# Altium project angry-bear.PrjPcb
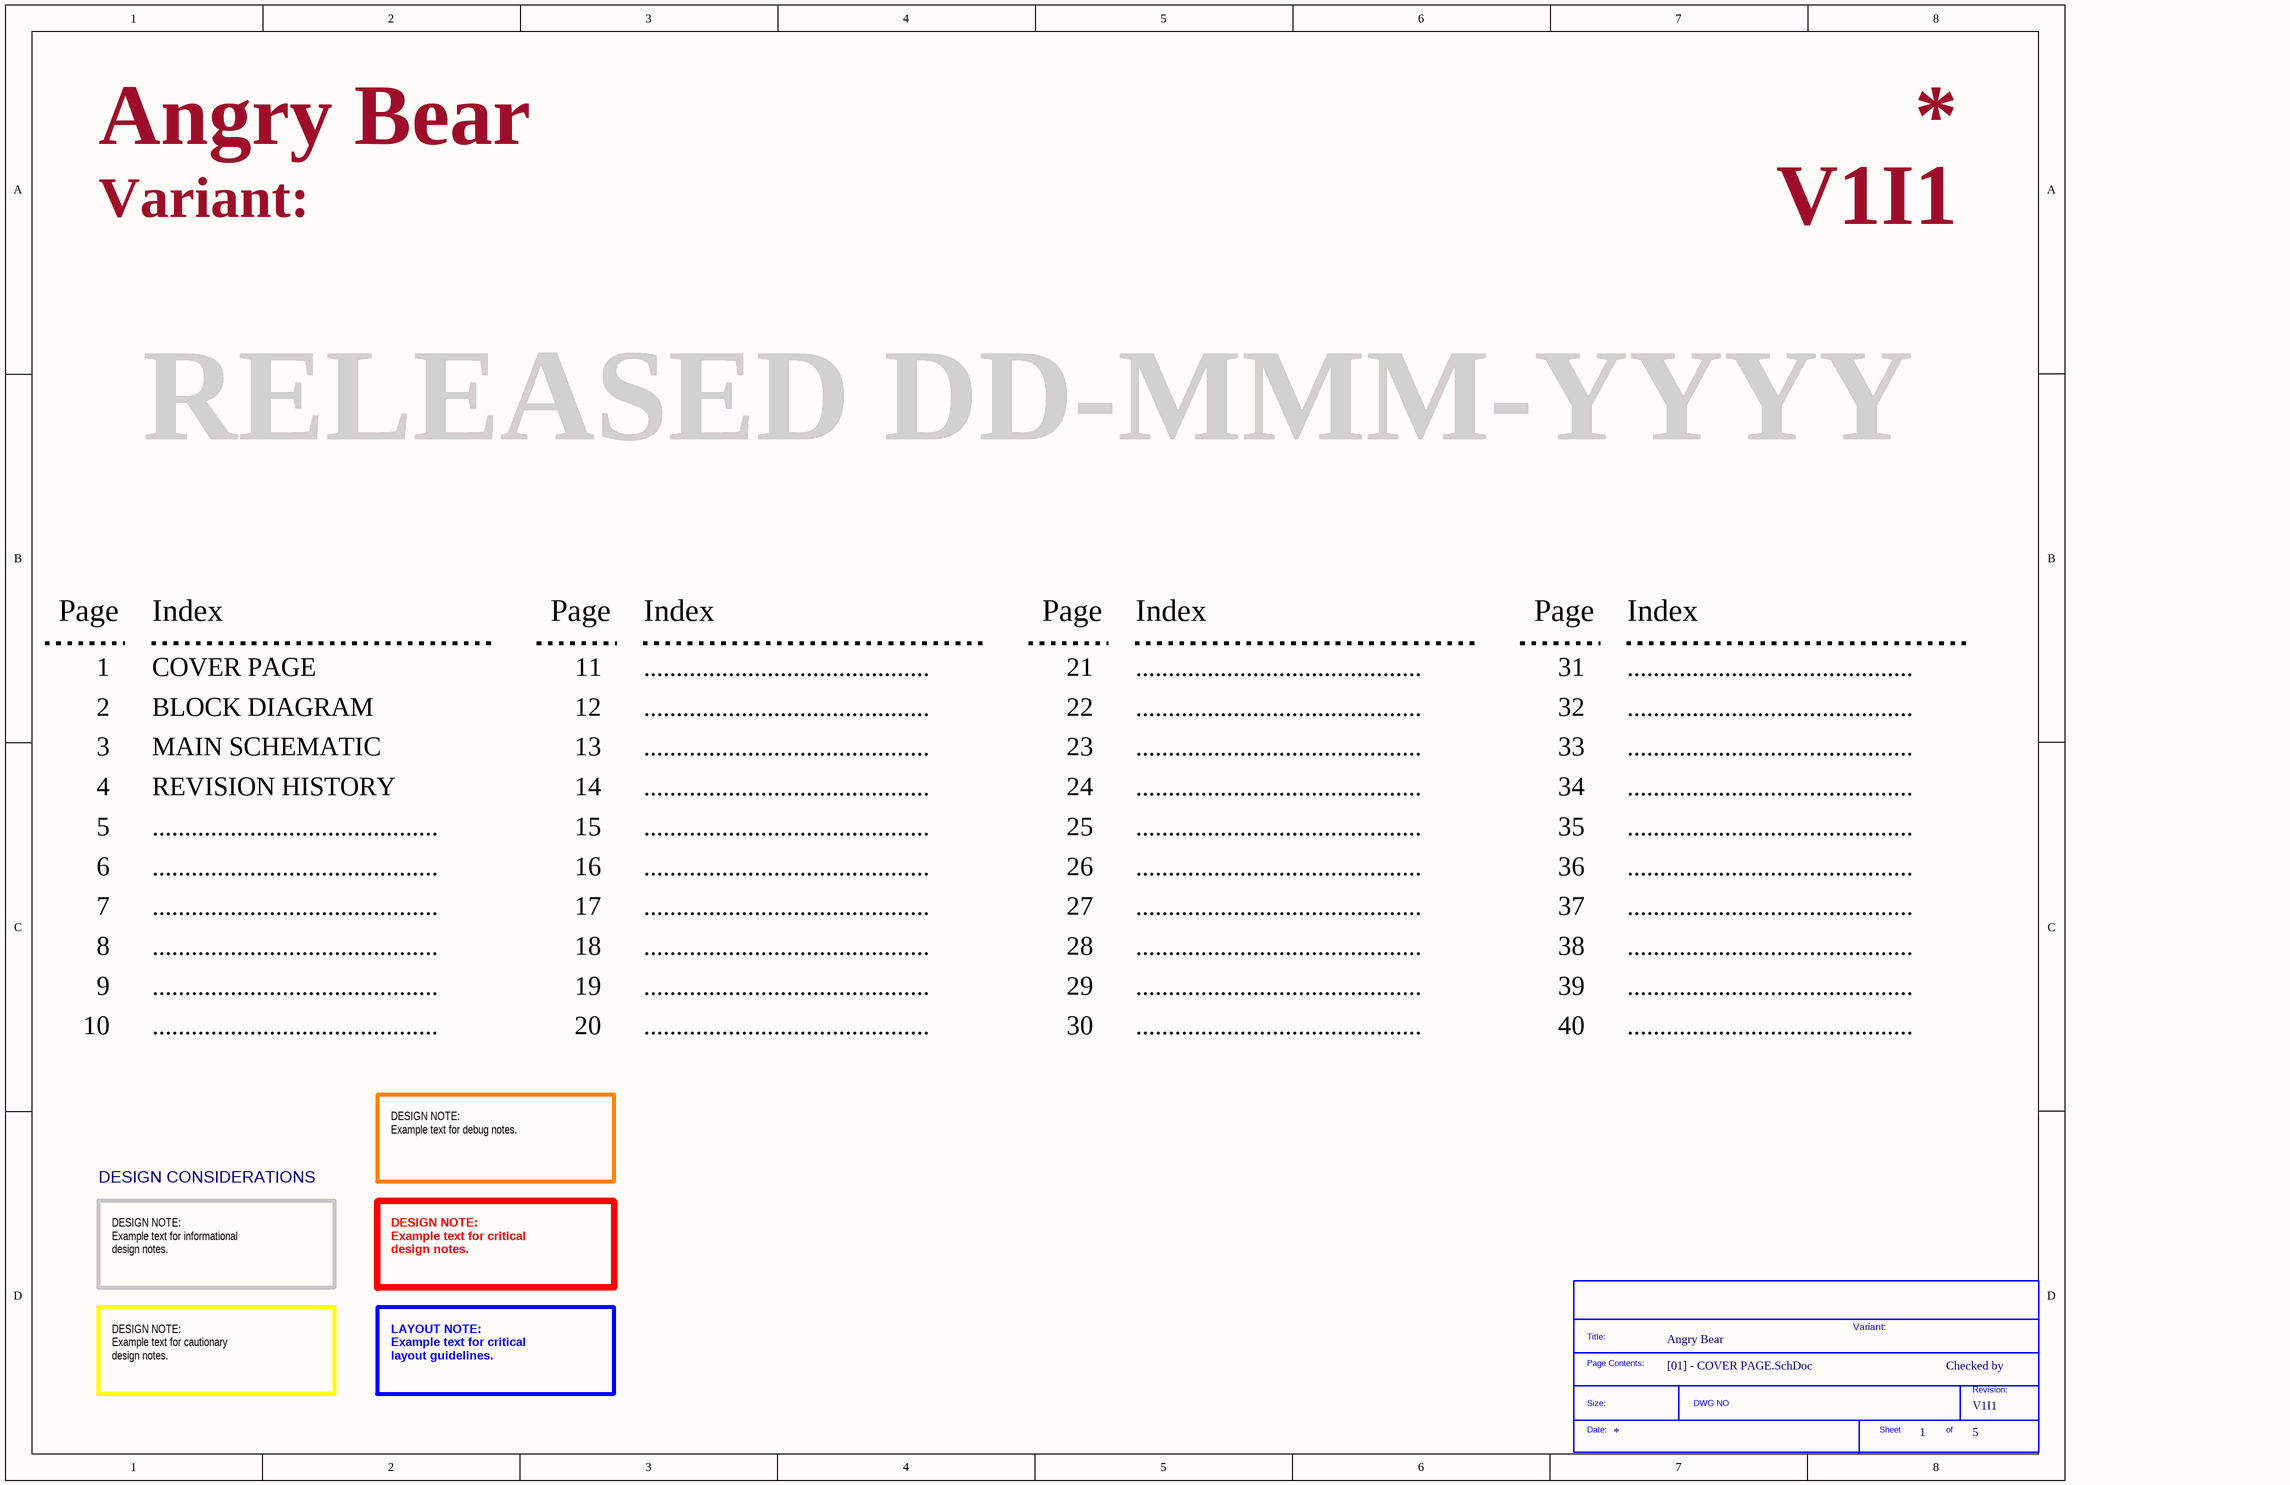
[diagram p0: [01] - COVER PAGE.SchDoc]
Project: Angry Bear; VersionRevision: V1I1
4 sheets, 22 parts. Net scope: global (net labels, ports and power ports of the same name join across sheets).
Sheets:
  [01] - COVER PAGE.SchDoc
  [02] - BLOCK DIAGRAM.SchDoc
  [03] - MAIN SCHEMATIC.SchDoc
  [04] - REVISION HISTORY.SchDoc

## Sheet [01] - COVER PAGE.SchDoc
size A3; DocumentNumber: 1; SheetNumber: 1; SheetTotal: 5

### Parts
(Parts that share a designator on the sheet are numbered #1, #2 ... from top to bottom, then left to right.)
*#1  SDTitleBlock  (value not drawn)  (graphical)

### Notes on the sheet
- Variant:
- RELEASED DD-MMM-YYYY
- Page
- Index
- 1
- COVER PAGE
- 11
- ............................................
- 21
- 31
- 2
- 3
- BLOCK DIAGRAM
- MAIN SCHEMATIC
- 12
- 13
- 22
- 23
- 32
- 33
- 4
- 5
- REVISION HISTORY
- 14
- 15
- 24
- 25
- 34
- 35
- 6
- 16
- 26
- 36
- 7
- 8
- 17
- 18
- 27
- 28
- 37
- 38
- 9
- 10
- 19
- 20
- 29
- 30
- 39
- 40
- DESIGN NOTE:
  Example text for debug notes.
- DESIGN CONSIDERATIONS
- DESIGN NOTE:
  Example text for informational
  design notes.
- DESIGN NOTE:
  Example text for critical
  design notes.
- Checked by
- DESIGN NOTE:
  Example text for cautionary
  design notes.
- LAYOUT NOTE:
  Example text for critical
  layout guidelines.
- (in symbol SDTitleBlock) Title:; Page Contents:; Revision:; Size:; DWG NO; Date:; Sheet; of

## Sheet [02] - BLOCK DIAGRAM.SchDoc
size A3; DocumentNumber: 2; SheetNumber: 2; SheetTotal: 5; PageSetup: Record=PageOptions|CenterHorizontal=True|CenterVertical=True|PrintScale=0.52|XCorrection=1.00|YCorrection=1.00|PrintKind=1|BorderSize=5000000|LeftOffset=0|BottomOffset=0|Orientation=2|PaperLength=1000|PaperWidth=1000|Scale=100|PaperSource=4|PrintQuality=600|MediaType=1|DitherType=10|PrintScaleMode=1|PaperKind=A4|PaperIndex=9
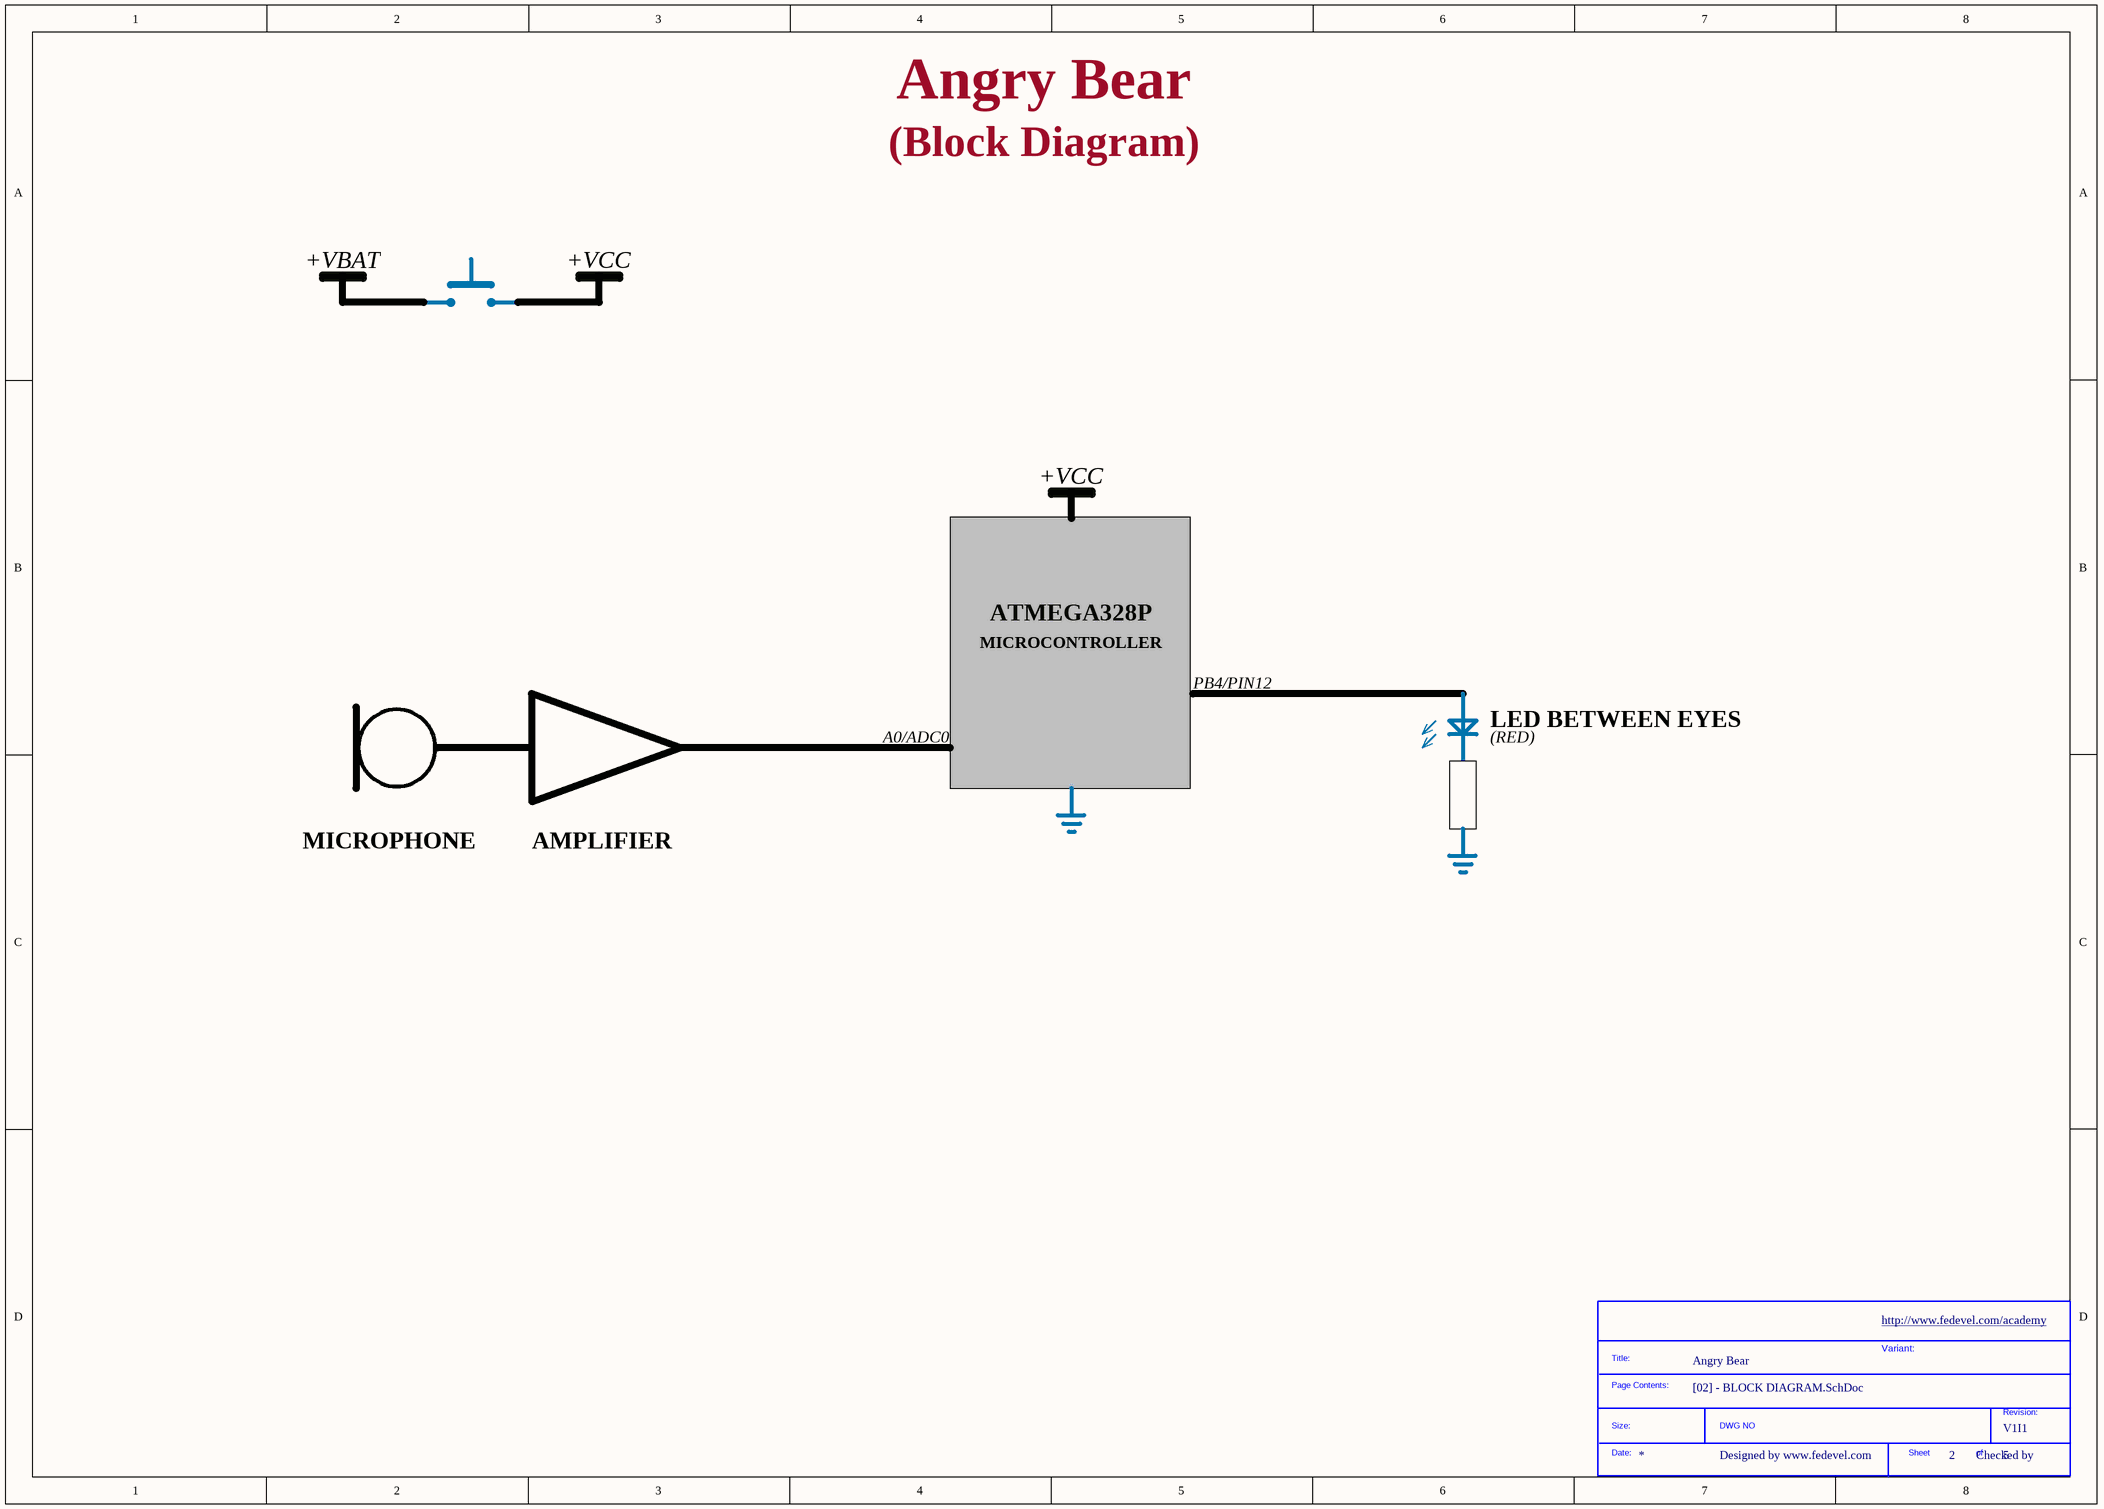
[diagram p1: [02] - BLOCK DIAGRAM.SchDoc]

### Parts
(Parts that share a designator on the sheet are numbered #1, #2 ... from top to bottom, then left to right.)
*#2  SDTitleBlock  (value not drawn)  (graphical)

### Notes on the sheet
- (Block Diagram)
- +VBAT
- +VCC
- ATMEGA328P
- MICROCONTROLLER
- PB4/PIN12
- A0/ADC0
- LED BETWEEN EYES
- (RED)
- MICROPHONE
- AMPLIFIER
- http://www.fedevel.com/academy
- Variant:
- Designed by www.fedevel.com
- Checked by
- (in symbol SDTitleBlock) Title:; Page Contents:; Revision:; Size:; DWG NO; Date:; Sheet; of

## Sheet [03] - MAIN SCHEMATIC.SchDoc
size A3; DocumentNumber: 2; SheetNumber: 2; SheetTotal: 5; PageSetup: Record=PageOptions|CenterHorizontal=True|CenterVertical=True|PrintScale=0.52|XCorrection=1.00|YCorrection=1.00|PrintKind=1|BorderSize=5000000|LeftOffset=0|BottomOffset=0|Orientation=2|PaperLength=1000|PaperWidth=1000|Scale=100|PaperSource=4|PrintQuality=600|MediaType=1|DitherType=10|PrintScaleMode=1|PaperKind=A4|PaperIndex=9
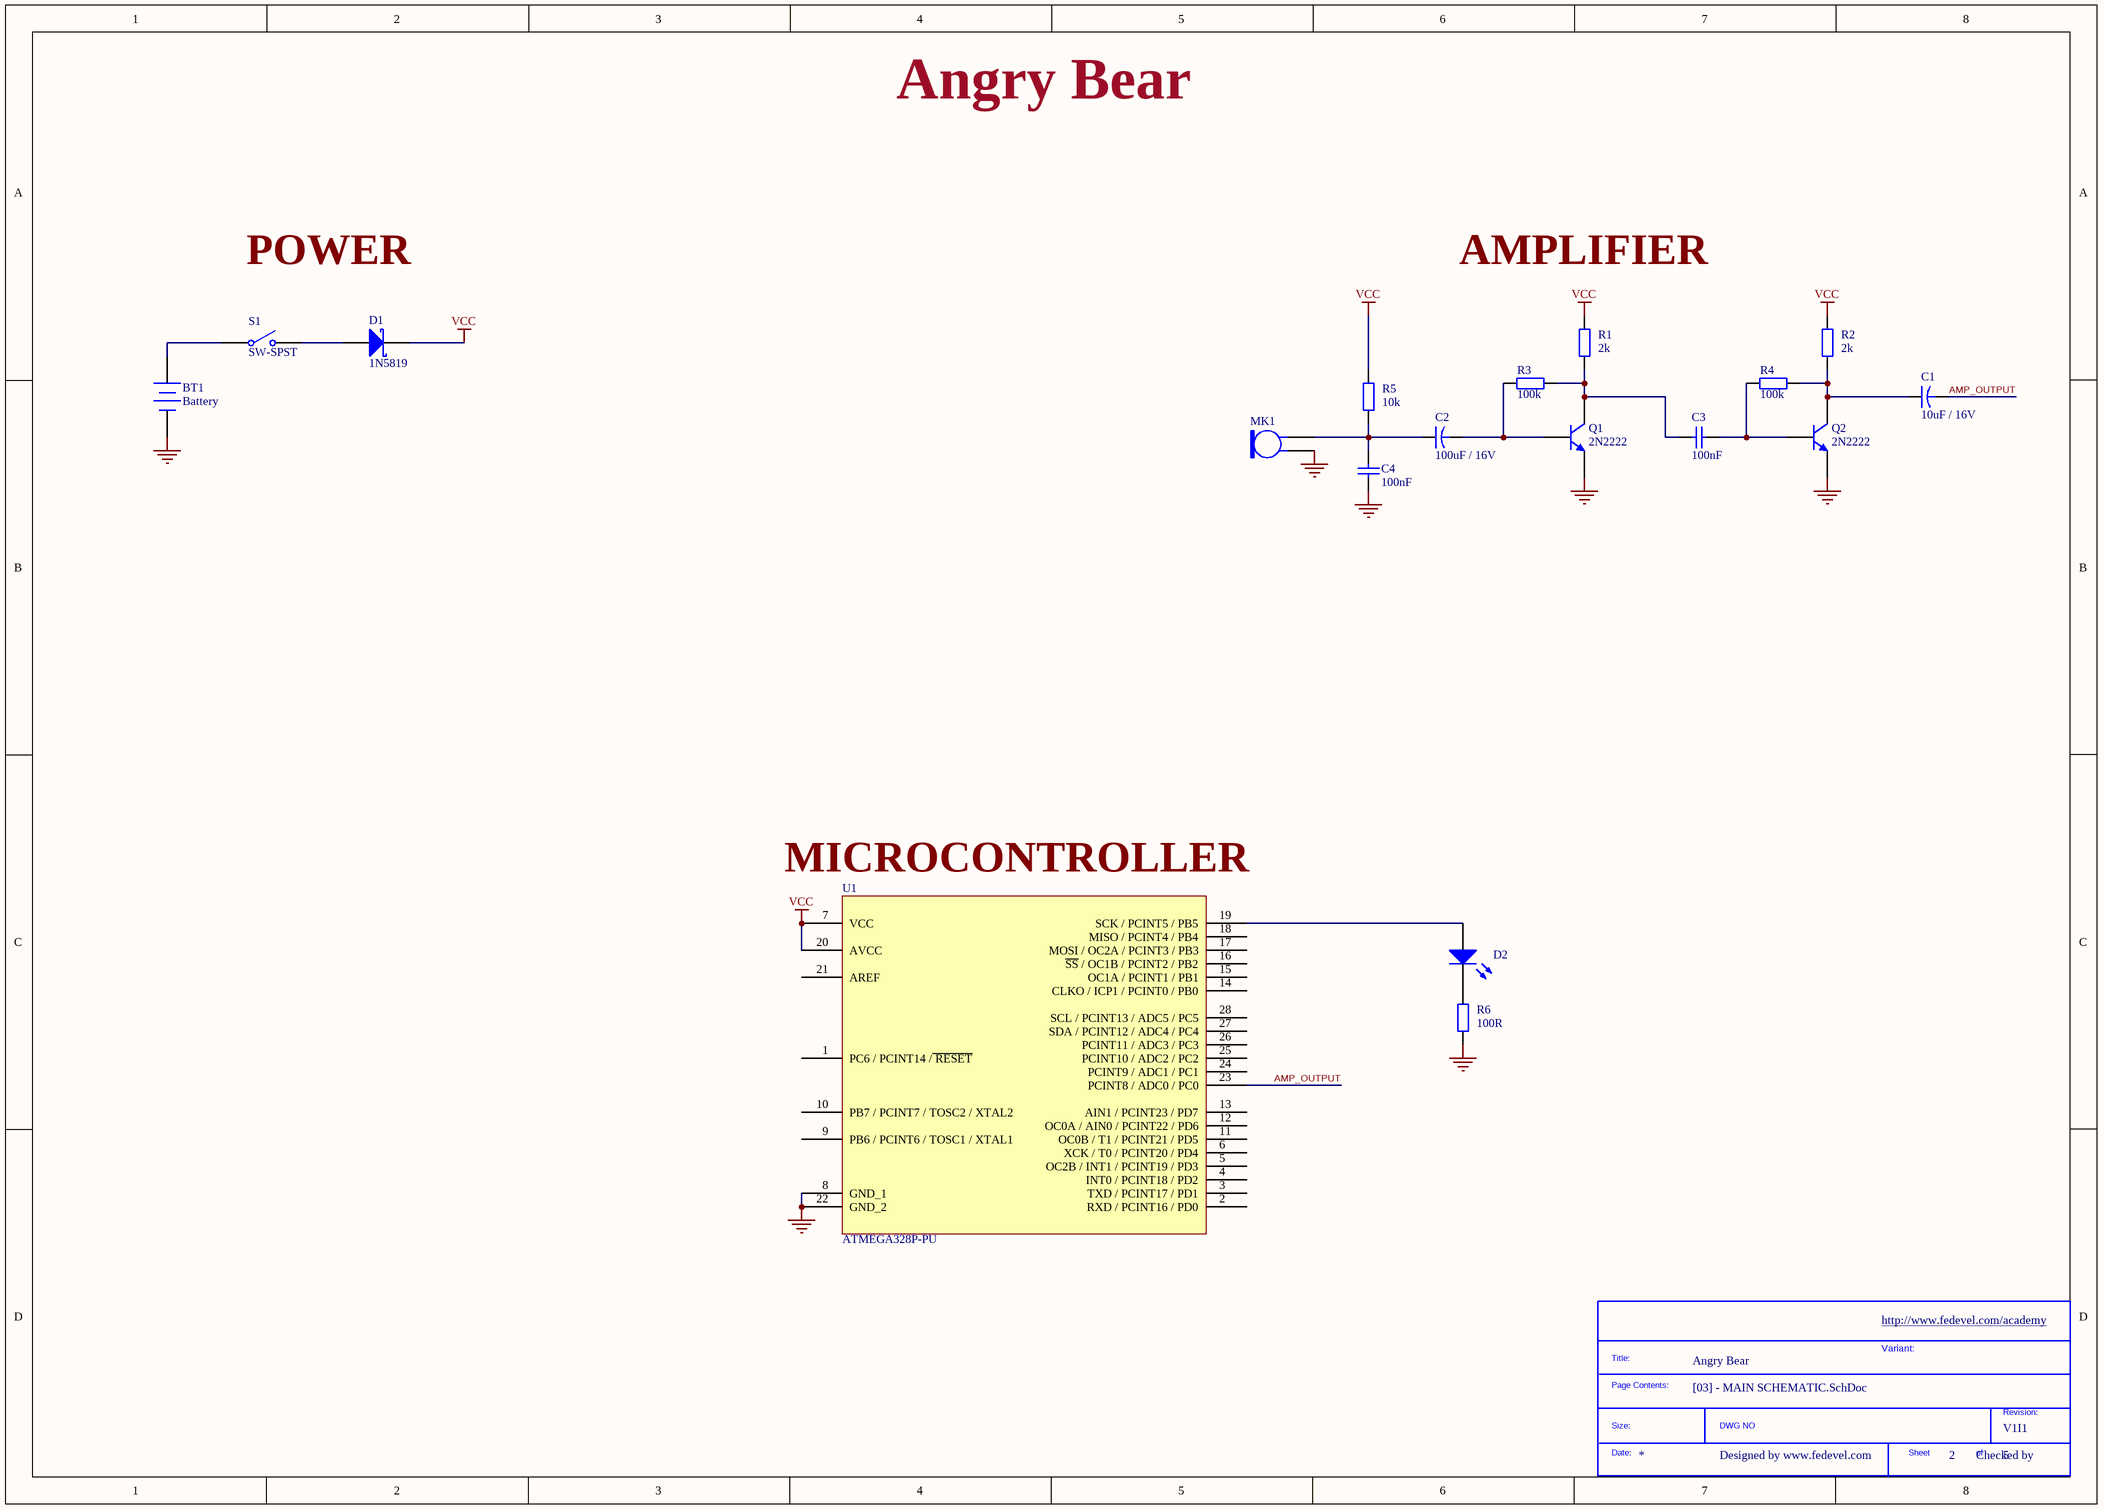
[diagram p2: [03] - MAIN SCHEMATIC.SchDoc]

### Parts
(Parts that share a designator on the sheet are numbered #1, #2 ... from top to bottom, then left to right.)
*#3  SDTitleBlock  (value not drawn)  (graphical)
BT1  Battery  [BAT-2]
C1  10uF / 16V  [CAPR5-4X5]
C2  100uF / 16V  [CAPR5-4X5]
C3  100nF  [RAD-0.3]
C4  100nF  [RAD-0.3]
D1  1N5819  [DO-204AL]
D2  LED0  [LED-0]  (value not drawn)
MK1  Mic2  [PIN2]  (value not drawn)
Q1  2N2222  [TO-226-AA]
Q2  2N2222  [TO-226-AA]
R1  2k  [AXIAL-0.4]
R2  2k  [AXIAL-0.4]
R3  100k  [AXIAL-0.4]
R4  100k  [AXIAL-0.4]
R5  10k  [AXIAL-0.4]
R6  100R  [AXIAL-0.4]
S1  SW-SPST  [SPST-2]
U1  ATMEGA328P-PU  [28_DIP_7.62mm]

### Nets
GND: BT1.2(-) C4.1 MK1.1 Q1.3(E) Q2.3(E) R6.1 U1.8(GND_1) U1.22(GND_2)
VCC: D1.2(K) R1.2 R2.2 R5.2 U1.7(VCC) U1.20(AVCC)
AMP_OUTPUT: C1.2 U1.23(PCINT8_/_ADC0_/_PC0)
NetBT1_1: BT1.1(+) S1.1(COMMON)
NetC1_1: C1.1 Q2.1(C) R2.1 R4.2
NetC2_1: C2.1 C4.2 MK1.2 R5.1
NetC2_2: C2.2 Q1.2(B) R3.1
NetC3_1: C3.1 Q1.1(C) R1.1 R3.2
NetC3_2: C3.2 Q2.2(B) R4.1
NetD1_1: D1.1(A) S1.2(NO)
NetD2_1: D2.1(A) U1.19(SCK_/_PCINT5_/_PB5)
NetD2_2: D2.2(K) R6.2

Not connected (* = marked no-connect by the designer): U1 1(PC6_/_PCINT14_/~{_RESET}) 2(RXD_/_PCINT16_/_PD0) 3(TXD_/_PCINT17_/_PD1) 4(INT0_/_PCINT18_/_PD2) 5(OC2B_/_INT1_/_PCINT19_/_PD3) 6(XCK_/_T0_/_PCINT20_/_PD4) 9(PB6_/_PCINT6_/_TOSC1_/_XTAL1) 10(PB7_/_PCINT7_/_TOSC2_/_XTAL2) 11(OC0B_/_T1_/_PCINT21_/_PD5) 12(OC0A_/_AIN0_/_PCINT22_/_PD6) 13(AIN1_/_PCINT23_/_PD7) 14(CLKO_/_ICP1_/_PCINT0_/_PB0) 15(OC1A_/_PCINT1_/_PB1) 16(~{SS}_/_OC1B_/_PCINT2_/_PB2) 17(MOSI_/_OC2A_/_PCINT3_/_PB3) 18(MISO_/_PCINT4_/_PB4) 21(AREF) 24(PCINT9_/_ADC1_/_PC1) 25(PCINT10_/_ADC2_/_PC2) 26(PCINT11_/_ADC3_/_PC3) 27(SDA_/_PCINT12_/_ADC4_/_PC4) 28(SCL_/_PCINT13_/_ADC5_/_PC5)

### Notes on the sheet
- POWER
- AMPLIFIER
- (near U1) MICROCONTROLLER
- http://www.fedevel.com/academy
- Variant:
- Designed by www.fedevel.com
- Checked by
- (in symbol SDTitleBlock) Title:; Page Contents:; Revision:; Size:; DWG NO; Date:; Sheet; of

### Library data of the parts
BT1 = Battery: Multicell Battery; Published: 24-Mar-1999; LatestRevisionDate: 17-Jul-2002; LatestRevisionNote: Re-released for DXP Platform.; PackageReference: BAT-2; Publisher: Altium Limited; PackageDescription: Battery; 2 Leads
C1 C2 = Cap2: Capacitor; Value: 100pF; Published: 23-Sep-2002; PackageReference: CAPR5-4X5; Publisher: Altium Limited; PackageDescription: Capacitor; 2 Leads
C3 C4 = Cap: Capacitor; Value: 100pF; Published: 8-Jun-2000; LatestRevisionDate: 17-Jul-2002; LatestRevisionNote: Re-released for DXP Platform.; PackageReference: RAD-0.3; Publisher: Altium Limited; PackageDescription: Radial Cap, Thru-Hole; 2 Leads; 0.3 in Pin Spacing
D1 = Diode 11DQ03: Schottky Rectifier; Published: 8-Jun-2000; LatestRevisionDate: 17-Jul-2002; LatestRevisionNote: Re-released for DXP Platform.; DatasheetVersion: Dec-1997; PackageReference: DO-204AL; Publisher: Altium Limited; PackageDescription: Diode, Axial; Body 5.2 x 2.7 mm (LxDia. max), Lead Dia. 0.86 mm (max); Code_JEDEC: DO-204-AL; ComponentLink1Description: Manufacturer Link; ComponentLink1URL: http://www.irf.com/; ComponentLink2Description: Datasheet; ComponentLink2URL: http://www.irf.com/product-info/datasheets/data/11dq03.pdf
D2 = LED0: Typical INFRARED GaAs LED; Published: 8-Jun-2000; LatestRevisionDate: 08-Jul-2005; LatestRevisionNote: Mech Layer 1 removed.; PackageReference: LED-0; Publisher: Altium Limited; PackageDescription: LED; 2 Leads
MK1 = Mic2: Microphone; Published: 24-Mar-1999; LatestRevisionDate: 17-Jul-2002; LatestRevisionNote: Re-released for DXP Platform.; PackageReference: PIN2; Publisher: Altium Limited
Q1 Q2 = NPN: NPN Bipolar Transistor; Manufacturer: ON Semiconductor; Manufacturer Part Number: P2N2222AG; Collector Emitter Voltage V(br)ceo: 40V; Transition Frequency ft: 300MHz; Power Dissipation Pd: 625mW; DC Collector Current: 600mA; DC Current Gain hFE: 300hFE; Transistor Case Style: TO-92; No. of Pins: 3Pins; SVHC: No SVHC (17-Dec-2015); Published: 8-Jun-2000; LatestRevisionDate: 17-Jul-2002; LatestRevisionNote: Re-released for DXP Platform.; PackageReference: TO-226-AA; Publisher: Altium Limited; PackageDescription: TO, Flat Index; 3 In-Line, Axial Leads; Body Dia. 4.8mm; Leads 0.55 x 0.51 mm (max); Code_JEDEC: TO-226-AA; Supplier 1: Newark; Supplier Part Number 1: 42K2503; Stock 1: 0; Transistor Polarity: NPN; Operating Temperature Max: 150°C; Product Range: -; Automotive Qualification Standard: -; MSL: MSL 1 - Unlimited; ComponentLink1URL: https://www.onsemi.com/pub/Collateral/P2N2222A-D.PDF?src-supplier=Digi-Key; ComponentLink1Description: https://www.onsemi.com/pub/Collateral/P2N2222A-D.PDF?src-supplier=Digi-Key; ComponentLink2URL: http://www.mouser.com/ds/2/308/on%20semiconductor_p2n2222a-d-548821.pdf?src-supplier=Mouser; ComponentLink2Description: http://www.mouser.com/ds/2/308/on%20semiconductor_p2n2222a-d-548821.pdf?src-supplier=Mouser; ComponentLink3URL: http://www.onsemi.com/pub/Collateral/P2N2222A-D.PDF?src-supplier=Avnet; ComponentLink3Description: http://www.onsemi.com/pub/Collateral/P2N2222A-D.PDF?src-supplier=Avnet; ComponentLink4URL: http://www.onsemi.com/pub/Collateral/P2N2222A-D.PDF?src-supplier=Avnet+Europe; ComponentLink4Description: http://www.onsemi.com/pub/Collateral/P2N2222A-D.PDF?src-supplier=Avnet+Europe; ComponentLink5URL: http://www.onsemi.com/pub_link/Collateral/P2N2222A-D.PDF?src-supplier=Future+Electronics; ComponentLink5Description: http://www.onsemi.com/pub_link/Collateral/P2N2222A-D.PDF?src-supplier=Future+Electronics; ComponentLink6URL: https://www.verical.com/server-webapp/html/getDatasheet?partID=69103&src-supplier=Verical; ComponentLink6Description: https://www.verical.com/server-webapp/html/getDatasheet?partID=69103&src-supplier=Verical
R1-R6 = Res2: Resistor; Value: 1K; Published: 8-Jun-2000; LatestRevisionDate: 17-Jul-2002; LatestRevisionNote: Re-released for DXP Platform.; PackageReference: AXIAL-0.4; Publisher: Altium Limited; PackageDescription: Axial Device, Thru-Hole; 2 Leads; 0.4 in Pin Spacing
S1 = SW-SPST: Single-Pole, Single-Throw Switch; Published: 24-Mar-1999; LatestRevisionDate: 17-Jul-2002; LatestRevisionNote: Re-released for DXP Platform.; PackageReference: SPST-2; Publisher: Altium Limited; PackageDescription: Switch; 2 Leads
U1 = ATMEGA328P-PU: IC MCU 8BIT 32KB FLASH 28DIP; Manufacturer: Atmel; Core Processor: AVR; Core Size: 8-Bit; Speed: 20MHz; Connectivity: I²C, SPI, UART/USART; Peripherals: Brown-out Detect/Reset, POR, PWM, WDT; Number of I/O: 23; Program Memory Size: 32KB (16K x 16); EEPROM Size: 1K x 8; RAM Size: 2K x 8; Voltage - Supply (Vcc/Vdd): 1.8 V ~ 5.5 V; Data Converters: A/D 6x10b; Oscillator Type: Internal; .Creator: MM; .Checked PCB: RF; Supplier 1: Digi-Key; Manufacturer Part Number: ATMEGA328P-PU; RoHS: RoHS Compliant; Category: Integrated Circuits (ICs); Stock 1: 47234; Pricing 1: 1=3.7, 10=3.305, 100=2.7103, 250=2.44588, 500=2.19468, 1000=1.85094 (USD); Packaging: Tube; Program Memory Type: FLASH; Operating Temperature: -40°C ~ 85°C; Package / Case: 28-DIP (0.300", 7.62mm); Supplier Device Package: 28-PDIP; ComponentLink1URL: http://www.atmel.com/images/atmel-8271-8-bit-avr-microcontroller-atmega48a-48pa-88a-88pa-168a-168pa-328-328p_datasheet_summary.pdf; ComponentLink1Description: http://www.atmel.com/images/atmel-8271-8-bit-avr-microcontroller-atmega48a-48pa-88a-88pa-168a-168pa-328-328p_datasheet_summary.pdf; Supplier Part Number 1: ATMEGA328P-PU-ND; .Checked SCH: RF

## Sheet [04] - REVISION HISTORY.SchDoc
size A3; DocumentNumber: 4; SheetNumber: 4; SheetTotal: 5
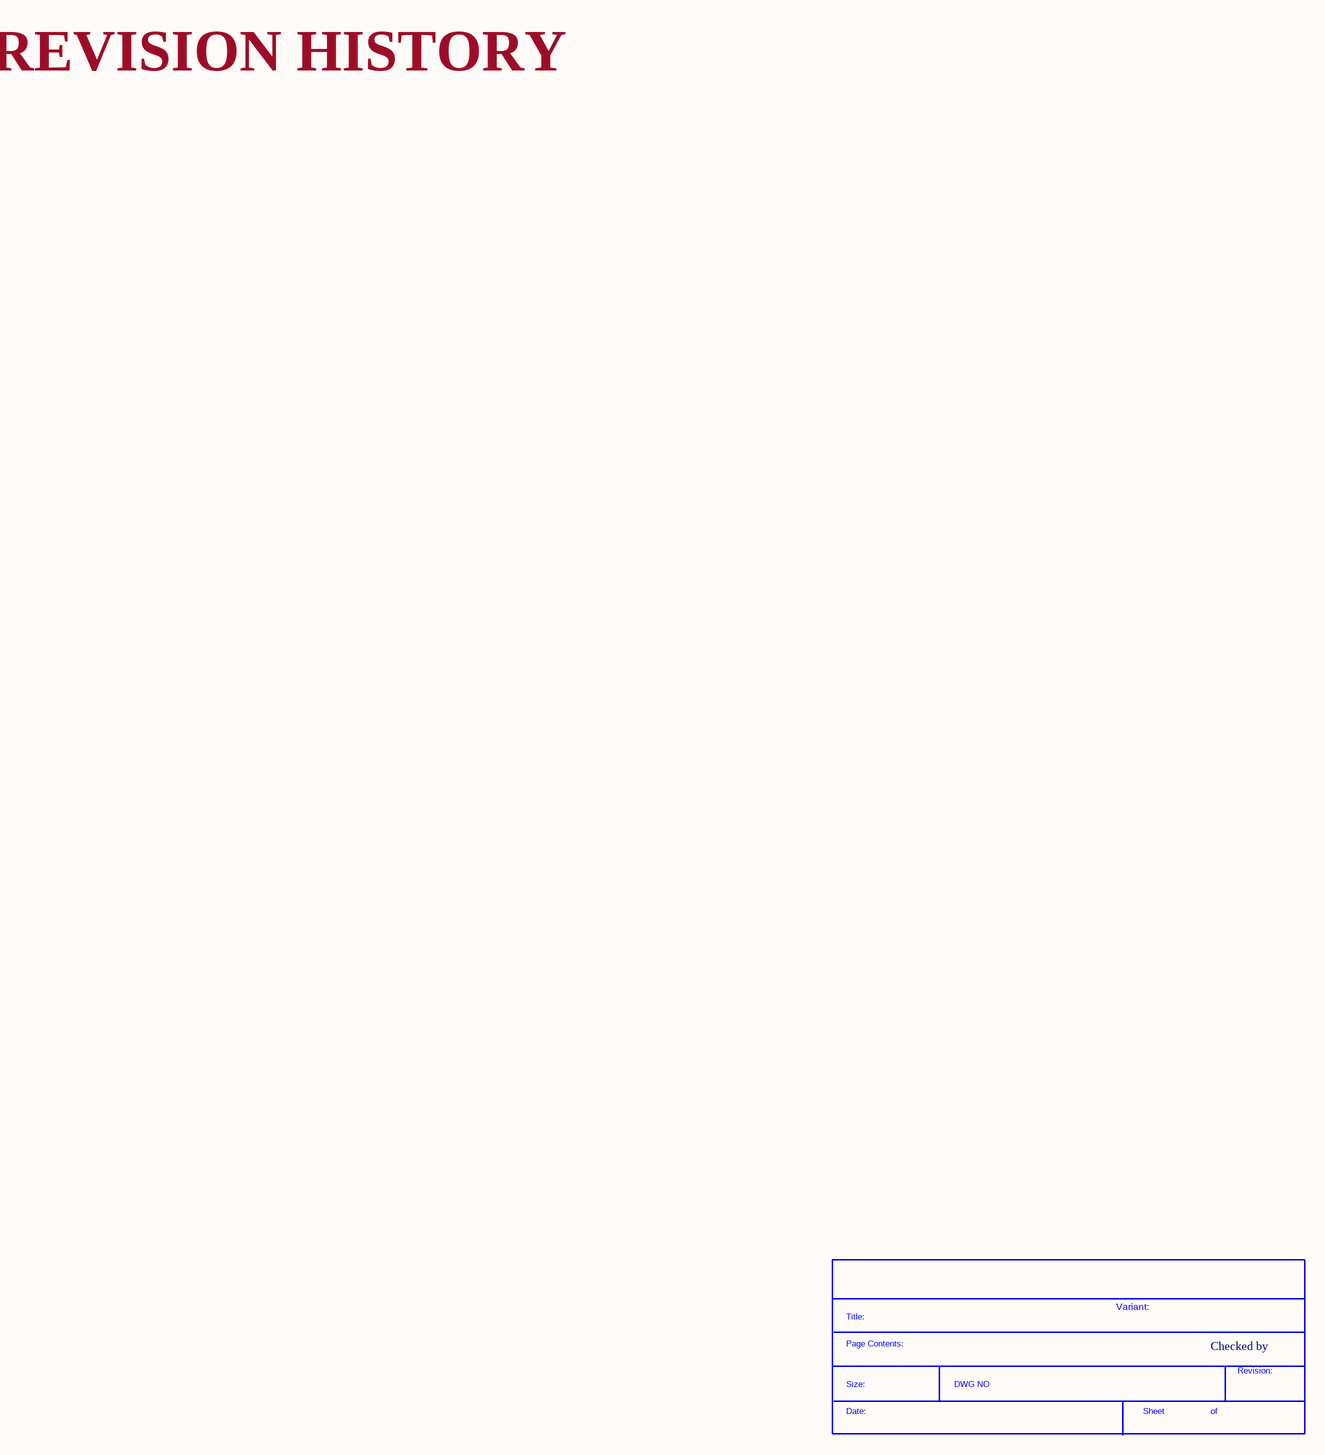
[diagram p3: [04] - REVISION HISTORY.SchDoc]

### Parts
(Parts that share a designator on the sheet are numbered #1, #2 ... from top to bottom, then left to right.)
*#4  SDTitleBlock  (value not drawn)  (graphical)

### Notes on the sheet
- REVISION HISTORY
- Variant:
- Checked by
- (in symbol SDTitleBlock) Title:; Page Contents:; Revision:; Size:; DWG NO; Date:; Sheet; of